# Altium schematic sheet Sheet1.SchDoc
size A
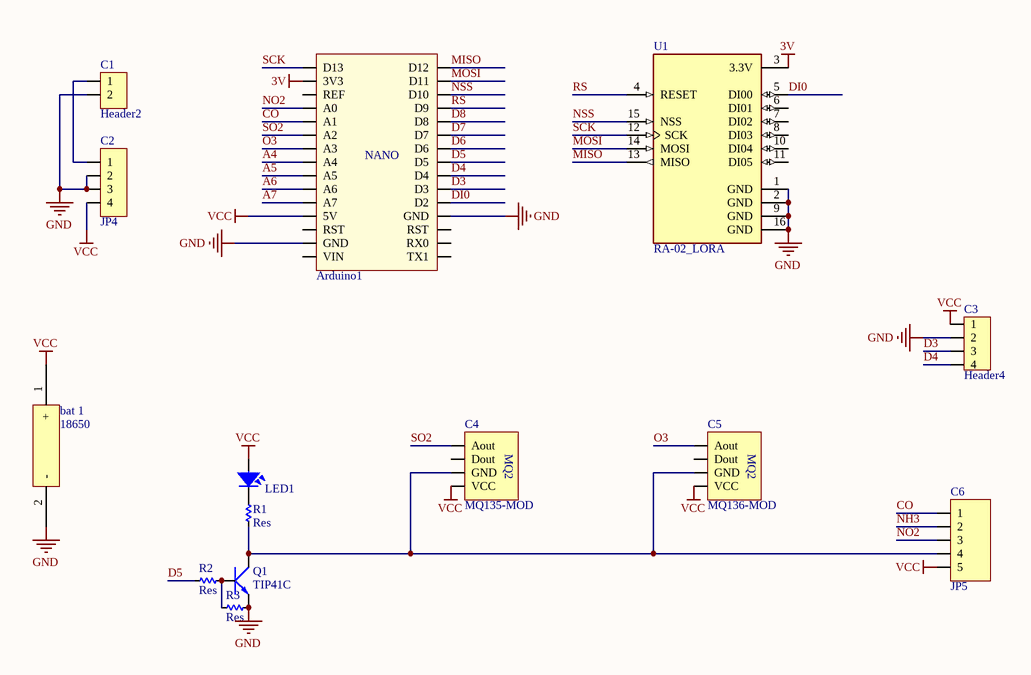
[diagram p0: Sheet1.SchDoc]

## Parts
Arduino1  Arduino Nano  [Arduino Nano]  (value not drawn)
bat_1  18650  [18650]
C1  Header2  [HDR2]
C2  JP4  [JP4-C1T]
C3  Header4  [HDR4]
C4  MQ135-MOD  [MQ2-MODULE]
C5  MQ136-MOD  [MQ2-MODULE]
C6  JP5  [JP5-C1T]
LED1  LED  [LED-5-BLUE]  (value not drawn)
Q1  TIP41C  [TO220-123]
R1  Res  [RES-1/8WD]
R2  Res  [RES-1/8WD]
R3  Res  [RES-1/8WD]
U1  RA-02_LORA  [MODULE_RA-02_LORA]

## Nets
3V: Arduino1.3V3 U1.3(3.3V)
GND: Arduino1.GND bat_1.2(-) C1.2 C2.2 C2.3 C3.2 Q1.3(E) R3.1 U1.1(GND) U1.2(GND) U1.9(GND) U1.16(GND)
VCC: Arduino1.5V bat_1.1(+) C2.4 C3.1 C4.4(VCC) C5.4(VCC) C6.5 LED1.1
A4: Arduino1.A4
A5: Arduino1.A5
A6: Arduino1.A6
A7: Arduino1.A7
CO: Arduino1.A1 C6.1
D3: Arduino1.D3 C3.3
D4: Arduino1.D4 C3.4
D5: Arduino1.D5 R2.2
D6: Arduino1.D6
D7: Arduino1.D7
D8: Arduino1.D8
DI0: Arduino1.D2 U1.5(DI00)
MISO: Arduino1.D12 U1.13(MISO)
MOSI: Arduino1.D11 U1.14(MOSI)
NH3: C6.2
NO2: Arduino1.A0 C6.3
NSS: Arduino1.D10 U1.15(NSS)
O3: Arduino1.A3 C5.1(Aout)
RS: Arduino1.D9 U1.4(RESET)
SCK: Arduino1.D13 U1.12(SCK)
SO2: Arduino1.A2 C4.1(Aout)
NetC1_1: C1.1 C2.1
NetC4_3: C4.3(GND) C5.3(GND) C6.4 Q1.2(C) R1.2
NetLED1_2: LED1.2 R1.1
NetQ1_1: Q1.1(B) R2.1 R3.2

Not connected (* = marked no-connect by the designer): Arduino1 REF RST RX0 TX1 VIN; C4 2(Dout); C5 2(Dout); U1 6(DI01) 7(DI02) 8(DI03) 10(DI04) 11(DI05)

## Notes on the sheet
- (in symbol Arduino Nano) NANO
- (in symbol MQ2-MOD) MQ2

## Library data of the parts
Arduino1 = Arduino Nano: Value: Cau 1A
C1 = Header2: Header IDC, 2 x 1 Pin Vertical 2.54mm Pitch (Non-Boxed, Male); Manufacturer: W¨¹rth Elektronik eiSos GmbH; partNo: 613002143121; ComponentLink1 Description: Manufacturer; ComponentLink2 Description: Datasheet; NoPins: 02; Created Date: 29 March 2013; ComponentLink1URL: http://www.we-online.com; ComponentLink2URL: http://katalog.we-online.de/em/datasheet/6130xx143121.pdf; Created by: Karrer Zheng
C2 = JP4: WR-PHD 2.54 mm Angled Socket Header; Manufacturer: W¨¹rth Elektronik eiSos GmbH; partNo: 613004143121; ComponentLink1 Description: Manufacturer; ComponentLink2 Description: Datasheet; NoPins: 04; Created Date: 29 March 2013; ComponentLink1URL: http://www.we-online.com; ComponentLink2URL: http://katalog.we-online.de/em/datasheet/6130xx143121.pdf; Created by: Karrer Zheng
C3 = Header4: Header IDC, 4 x 1 Pin Vertical 2.54mm Pitch (Non-Boxed, Male); Manufacturer: W¨¹rth Elektronik eiSos GmbH; partNo: 613002143121; ComponentLink1 Description: Manufacturer; ComponentLink2 Description: Datasheet; NoPins: 02; Created Date: 29 March 2013; ComponentLink1URL: http://www.we-online.com; ComponentLink2URL: http://katalog.we-online.de/em/datasheet/6130xx143121.pdf; Created by: Karrer Zheng
C4 C5 = MQ2-MOD: Manufacturer: W¨¹rth Elektronik eiSos GmbH; partNo: 613004143121; ComponentLink1 Description: Manufacturer; ComponentLink2 Description: Datasheet; NoPins: 04; Created Date: 29 March 2013; ComponentLink1URL: http://www.we-online.com; ComponentLink2URL: http://katalog.we-online.de/em/datasheet/6130xx143121.pdf; Created by: Karrer Zheng
C6 = JP5: WR-PHD 2.54 mm Angled Socket Header; Manufacturer: W¨¹rth Elektronik eiSos GmbH; partNo: 613005143121; ComponentLink1 Description: Manufacturer; ComponentLink2 Description: Datasheet; NoPins: 05; Created Date: 29 March 2013; ComponentLink1URL: http://www.we-online.com; ComponentLink2URL: http://katalog.we-online.de/em/datasheet/6130xx143121.pdf; Created by: Karrer Zheng
LED1 = LED: LED Single colour Green and Red; Value: LED 3 ly Single Colour
Q1 = TIP41C: NPN 2W, BCE; Value: TIP41C
R1-R3 = Res: Manufacturer: Generic Components; Class: Passive; SubClass: R; Published: 08/06/2000; Publisher: Altium Hobart Technology Centre
U1 = RA-02_LORA: Ra-02 LoRa RF M5Stack Platform Evaluation Expansion Board; MF: AI-Thinker; Package: Package; Availability: Unavailable; Value: *; MP: Ra-02 LoRa; Check_prices: https://www.snapeda.com/parts/Ra-02%20LoRa/AI-Thinker/view-part/4449259/?ref=eda; SnapEDA_Link: https://www.snapeda.com/parts/Ra-02%20LoRa/AI-Thinker/view-part/4449259/?ref=snap; Price: None